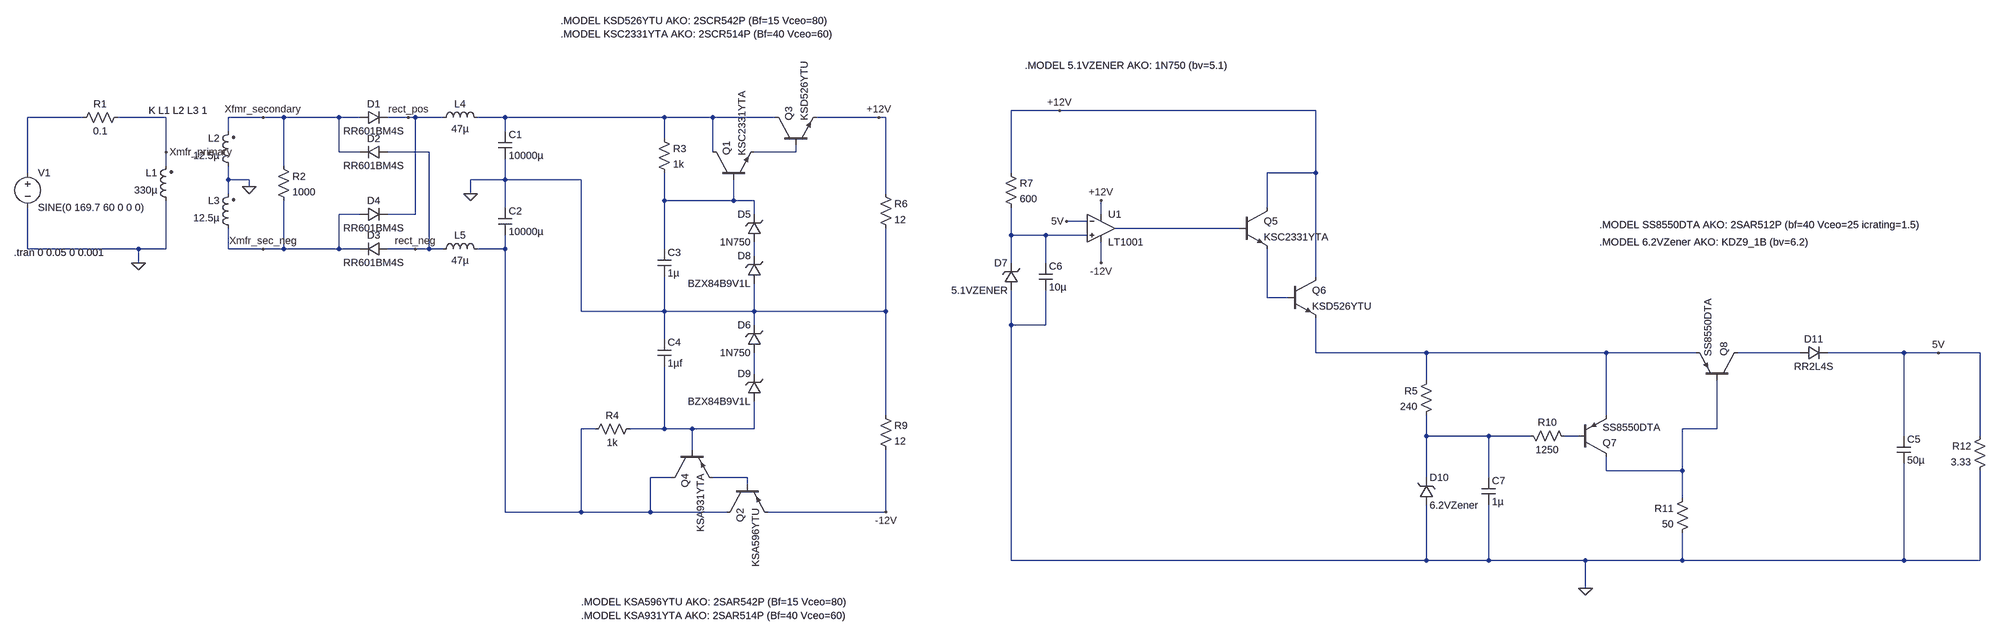
[diagram p0: schematic Power Supply V2.asc]
Power Supply V2.asc, the LTspice schematic file:
Version 4
SHEET 1 4836 1164
WIRE 2448 -16 2336 -16
WIRE 3040 -16 2448 -16
WIRE 32 0 -96 0
WIRE 224 0 112 0
WIRE 448 0 368 0
WIRE 496 0 448 0
WIRE 624 0 496 0
WIRE 672 0 624 0
WIRE 784 0 736 0
WIRE 800 0 784 0
WIRE 864 0 800 0
WIRE 1008 0 944 0
WIRE 1376 0 1008 0
WIRE 1488 0 1376 0
WIRE 1632 0 1488 0
WIRE 1872 0 1728 0
WIRE 1888 0 1872 0
WIRE 368 32 368 0
WIRE 1008 32 1008 0
WIRE 1376 48 1376 0
WIRE 224 80 224 0
WIRE 624 80 624 0
WIRE 672 80 624 80
WIRE 832 80 736 80
WIRE 1488 80 1488 0
WIRE 1680 80 1680 64
WIRE 1680 80 1584 80
WIRE 224 112 224 80
WIRE 496 112 496 0
WIRE -96 128 -96 0
WIRE 2336 128 2336 -16
WIRE 3040 128 3040 -16
WIRE 3040 128 2928 128
WIRE 368 144 368 112
WIRE 416 144 368 144
WIRE 1008 144 1008 96
WIRE 1008 144 928 144
WIRE 1184 144 1008 144
WIRE 416 160 416 144
WIRE 368 176 368 144
WIRE 928 176 928 144
WIRE 1888 176 1888 0
WIRE 1376 192 1376 128
WIRE 1536 192 1536 144
WIRE 1536 192 1376 192
WIRE 1584 192 1536 192
WIRE 1008 208 1008 144
WIRE 2928 208 2928 128
WIRE 672 224 624 224
WIRE 800 224 800 0
WIRE 800 224 736 224
WIRE 1584 224 1584 192
WIRE 2544 224 2544 192
WIRE 2512 240 2464 240
WIRE 2864 256 2576 256
WIRE 2336 272 2336 208
WIRE 2416 272 2336 272
WIRE 2512 272 2416 272
WIRE -96 304 -96 208
WIRE 160 304 -96 304
WIRE 224 304 224 192
WIRE 224 304 160 304
WIRE 368 304 368 256
WIRE 448 304 368 304
WIRE 496 304 496 192
WIRE 496 304 448 304
WIRE 624 304 624 224
WIRE 624 304 496 304
WIRE 672 304 624 304
WIRE 800 304 736 304
WIRE 832 304 832 80
WIRE 832 304 800 304
WIRE 864 304 832 304
WIRE 1008 304 1008 272
WIRE 1008 304 944 304
WIRE 1376 304 1376 192
WIRE 1584 320 1584 288
WIRE 160 336 160 304
WIRE 2336 336 2336 272
WIRE 2416 336 2416 272
WIRE 2544 336 2544 288
WIRE 3040 368 3040 128
WIRE 2928 416 2928 304
WIRE 2976 416 2928 416
WIRE 1184 448 1184 144
WIRE 1376 448 1376 368
WIRE 1376 448 1184 448
WIRE 1584 448 1584 384
WIRE 1584 448 1376 448
WIRE 1888 448 1888 256
WIRE 1888 448 1584 448
WIRE 1584 480 1584 448
WIRE 2336 480 2336 400
WIRE 2416 480 2416 400
WIRE 2416 480 2336 480
WIRE 1376 512 1376 448
WIRE 3040 544 3040 464
WIRE 3296 544 3040 544
WIRE 3712 544 3296 544
WIRE 3920 544 3712 544
WIRE 4160 544 4016 544
WIRE 4400 544 4224 544
WIRE 4480 544 4400 544
WIRE 4576 544 4480 544
WIRE 1584 592 1584 544
WIRE 3296 608 3296 544
WIRE 1888 688 1888 448
WIRE 3712 688 3712 544
WIRE 1216 720 1184 720
WIRE 1376 720 1376 576
WIRE 1376 720 1296 720
WIRE 1440 720 1376 720
WIRE 1584 720 1584 656
WIRE 1584 720 1440 720
WIRE 3968 720 3968 608
WIRE 3968 720 3888 720
WIRE 3296 736 3296 688
WIRE 3440 736 3296 736
WIRE 3536 736 3440 736
WIRE 3648 736 3616 736
WIRE 4400 736 4400 544
WIRE 4576 736 4576 544
WIRE 1440 768 1440 720
WIRE 3712 816 3712 784
WIRE 3888 816 3888 720
WIRE 3888 816 3712 816
WIRE 1392 832 1344 832
WIRE 1568 832 1488 832
WIRE 3296 832 3296 736
WIRE 3440 832 3440 736
WIRE 1568 848 1568 832
WIRE 3888 880 3888 816
WIRE 1008 912 1008 304
WIRE 1184 912 1184 720
WIRE 1184 912 1008 912
WIRE 1344 912 1344 832
WIRE 1344 912 1184 912
WIRE 1520 912 1344 912
WIRE 1888 912 1888 768
WIRE 1888 912 1616 912
WIRE 2336 1024 2336 480
WIRE 3296 1024 3296 896
WIRE 3296 1024 2336 1024
WIRE 3440 1024 3440 896
WIRE 3440 1024 3296 1024
WIRE 3664 1024 3440 1024
WIRE 3888 1024 3888 960
WIRE 3888 1024 3664 1024
WIRE 4400 1024 4400 800
WIRE 4400 1024 3888 1024
WIRE 4576 1024 4576 816
WIRE 4576 1024 4400 1024
WIRE 3664 1088 3664 1024
FLAG 416 160 0
FLAG 160 336 0
FLAG 224 80 Xmfr_primary
FLAG 448 0 Xfmr_secondary
FLAG 448 304 Xmfr_sec_neg
FLAG 928 176 0
FLAG 800 304 rect_neg
FLAG 784 0 rect_pos
FLAG 1872 0 +12V
FLAG 1888 912 -12V
FLAG 2544 192 +12V
FLAG 2544 336 -12V
FLAG 2448 -16 +12V
FLAG 3664 1088 0
FLAG 2464 240 5V
FLAG 4480 544 5V
SYMBOL res 128 -16 R90
WINDOW 0 0 56 VBottom 2
WINDOW 3 32 56 VTop 2
SYMATTR InstName R1
SYMATTR Value 0.1
SYMBOL voltage -96 112 R0
WINDOW 123 0 0 Left 2
WINDOW 39 0 0 Left 2
SYMATTR InstName V1
SYMATTR Value SINE(0 169.7 60 0 0 0)
SYMBOL res 480 96 R0
SYMATTR InstName R2
SYMATTR Value 1000
SYMBOL ind2 240 208 R180
WINDOW 0 36 80 Left 2
WINDOW 3 36 40 Left 2
SYMATTR InstName L1
SYMATTR Value 330µ
SYMATTR Type ind
SYMBOL ind2 384 128 R180
WINDOW 0 36 80 Left 2
WINDOW 3 36 40 Left 2
SYMATTR InstName L2
SYMATTR Value 12.5µ
SYMATTR Type ind
SYMBOL ind2 384 272 R180
WINDOW 0 36 80 Left 2
WINDOW 3 36 40 Left 2
SYMATTR InstName L3
SYMATTR Value 12.5µ
SYMATTR Type ind
SYMBOL diode 672 16 R270
WINDOW 0 32 32 VTop 2
WINDOW 3 0 32 VBottom 2
SYMATTR InstName D1
SYMATTR Value RR601BM4S
SYMBOL diode 736 64 R90
WINDOW 0 0 32 VBottom 2
WINDOW 3 32 32 VTop 2
SYMATTR InstName D2
SYMATTR Value RR601BM4S
SYMBOL diode 736 288 R90
WINDOW 0 0 32 VBottom 2
WINDOW 3 32 32 VTop 2
SYMATTR InstName D3
SYMATTR Value RR601BM4S
SYMBOL diode 672 240 R270
WINDOW 0 32 32 VTop 2
WINDOW 3 0 32 VBottom 2
SYMATTR InstName D4
SYMATTR Value RR601BM4S
SYMBOL cap 992 32 R0
SYMATTR InstName C1
SYMATTR Value 10000µ
SYMBOL cap 992 208 R0
SYMATTR InstName C2
SYMATTR Value 10000µ
SYMBOL ind 848 16 R270
WINDOW 0 32 56 VTop 2
WINDOW 3 5 56 VBottom 2
SYMATTR InstName L4
SYMATTR Value 47µ
SYMBOL ind 848 320 R270
WINDOW 0 32 56 VTop 2
WINDOW 3 5 56 VBottom 2
SYMATTR InstName L5
SYMATTR Value 47µ
SYMBOL pnp 1520 848 M90
SYMATTR InstName Q2
SYMATTR Value KSA596YTU
SYMBOL res 1312 704 R90
WINDOW 0 0 56 VBottom 2
WINDOW 3 32 56 VTop 2
SYMATTR InstName R4
SYMATTR Value 1k
SYMBOL npn 1632 64 R270
SYMATTR InstName Q3
SYMATTR Value KSD526YTU
SYMBOL npn 1488 144 R270
SYMATTR InstName Q1
SYMATTR Value KSC2331YTA
SYMBOL res 1360 32 R0
SYMATTR InstName R3
SYMATTR Value 1k
SYMBOL pnp 1392 768 M90
SYMATTR InstName Q4
SYMATTR Value KSA931YTA
SYMBOL cap 1360 512 R0
SYMATTR InstName C4
SYMATTR Value 1µf
SYMBOL Opamps\\LT1001 2544 192 R0
SYMATTR InstName U1
SYMBOL zener 2352 400 R180
WINDOW 0 24 64 Left 2
WINDOW 3 24 0 Left 2
SYMATTR InstName D7
SYMATTR Value 5.1VZENER
SYMBOL res 2320 112 R0
SYMATTR InstName R7
SYMATTR Value 600
SYMBOL npn 2864 208 R0
SYMATTR InstName Q5
SYMATTR Value KSC2331YTA
SYMBOL npn 2976 368 R0
SYMATTR InstName Q6
SYMATTR Value KSD526YTU
SYMBOL res 1872 160 R0
SYMATTR InstName R6
SYMATTR Value 12
SYMBOL res 1872 672 R0
SYMATTR InstName R9
SYMATTR Value 12
SYMBOL cap 1360 304 R0
SYMATTR InstName C3
SYMATTR Value 1µ
SYMBOL zener 1600 288 R180
WINDOW 0 24 64 Left 2
WINDOW 3 24 0 Left 2
SYMATTR InstName D5
SYMATTR Value 1N750
SYMBOL zener 1600 384 R180
WINDOW 0 24 64 Left 2
WINDOW 3 24 0 Left 2
SYMATTR InstName D8
SYMATTR Value BZX84B9V1L
SYMBOL zener 1600 544 R180
WINDOW 0 24 64 Left 2
WINDOW 3 24 0 Left 2
SYMATTR InstName D6
SYMATTR Value 1N750
SYMBOL zener 1600 656 R180
WINDOW 0 24 64 Left 2
WINDOW 3 24 0 Left 2
SYMATTR InstName D9
SYMATTR Value BZX84B9V1L
SYMBOL cap 2400 336 R0
SYMATTR InstName C6
SYMATTR Value 10µ
SYMBOL res 3312 592 M0
SYMATTR InstName R5
SYMATTR Value 240
SYMBOL res 3520 720 M90
WINDOW 0 0 56 VBottom 2
WINDOW 3 32 56 VTop 2
SYMATTR InstName R10
SYMATTR Value 1250
SYMBOL pnp 3648 784 M180
SYMATTR InstName Q7
SYMATTR Value SS8550DTA
SYMBOL res 3904 864 M0
SYMATTR InstName R11
SYMATTR Value 50
SYMBOL pnp 4016 608 M270
SYMATTR InstName Q8
SYMATTR Value SS8550DTA
SYMBOL res 4592 720 M0
SYMATTR InstName R12
SYMATTR Value 3.33
SYMBOL zener 3280 896 M180
WINDOW 0 24 64 Left 2
WINDOW 3 24 0 Left 2
SYMATTR InstName D10
SYMATTR Value 6.2VZener
SYMBOL diode 4160 528 M90
WINDOW 0 0 32 VBottom 2
WINDOW 3 32 32 VTop 2
SYMATTR InstName D11
SYMATTR Value RR2L4S
SYMBOL cap 4384 736 R0
SYMATTR InstName C5
SYMATTR Value 50µ
SYMBOL cap 3424 832 R0
SYMATTR InstName C7
SYMATTR Value 1µ
TEXT 184 -16 Left 2 !K L1 L2 L3 1
TEXT -128 312 Left 2 !.tran 0 0.05 0 0.001
TEXT 1136 -224 Left 2 !.MODEL KSD526YTU AKO: 2SCR542P (Bf=15 Vceo=80)\n.MODEL KSC2331YTA AKO: 2SCR514P (Bf=40 Vceo=60)
TEXT 2368 -120 Left 2 !.MODEL 5.1VZENER AKO: 1N750 (bv=5.1)
TEXT 1184 1120 Left 2 !.MODEL KSA596YTU AKO: 2SAR542P (Bf=15 Vceo=80)\n.MODEL KSA931YTA AKO: 2SAR514P (Bf=40 Vceo=60)
TEXT 3696 288 Left 2 !.MODEL 6.2VZener AKO: KDZ9_1B (bv=6.2)
TEXT 3696 248 Left 2 !.MODEL SS8550DTA AKO: 2SAR512P (bf=40 Vceo=25 icrating=1.5)

The netlist it stands for:
* Power Supply V2.asc
R1 Xmfr_primary N001 0.1
V1 N001 0 SINE(0 169.7 60 0 0 0)
R2 Xfmr_secondary Xmfr_sec_neg 1000
L1 0 Xmfr_primary 330µ
L2 0 Xfmr_secondary 12.5µ
L3 Xmfr_sec_neg 0 12.5µ
D1 Xfmr_secondary rect_pos RR601BM4S
D2 rect_neg Xfmr_secondary RR601BM4S
D3 rect_neg Xmfr_sec_neg RR601BM4S
D4 Xmfr_sec_neg rect_pos RR601BM4S
C1 N002 0 10000µ
C2 0 N007 10000µ
L4 rect_pos N002 47µ
L5 rect_neg N007 47µ
Q2 N007 N017 -12V 0 KSA596YTU
R4 N013 N007 1k
Q3 N002 N003 +12V 0 KSD526YTU
Q1 N002 N004 N003 0 KSC2331YTA
R3 N002 N004 1k
Q4 N007 N013 N017 0 KSA931YTA
C4 0 N013 1µf
XU1 N006 5V +12V -12V N005 LT1001  ; pins In+ In- V+ V- OUT
D7 0 N006 5.1VZENER
R7 +12V N006 600
Q5 +12V N005 N009 0 KSC2331YTA
Q6 +12V N009 N010 0 KSD526YTU
R6 +12V 0 12
R9 0 -12V 12
C3 N004 0 1µ
D5 N008 N004 1N750
D8 0 N008 BZX84B9V1L
D6 N012 0 1N750
D9 N013 N012 BZX84B9V1L
C6 N006 0 10µ
R5 N010 N015 240
R10 N015 N016 1250
Q7 N014 N016 N010 0 SS8550DTA
R11 N014 0 50
Q8 N011 N014 N010 0 SS8550DTA
R12 5V 0 3.33
D10 0 N015 6.2VZener
D11 N011 5V RR2L4S
C5 5V 0 50µ
C7 N015 0 1µ
.model D D
.lib standard.dio
.model NPN NPN
.model PNP PNP
.lib standard.bjt
K L1 L2 L3 1
.tran 0 0.05 0 0.001
.MODEL KSD526YTU AKO: 2SCR542P (Bf=15 Vceo=80)
.MODEL KSC2331YTA AKO: 2SCR514P (Bf=40 Vceo=60)
.MODEL 5.1VZENER AKO: 1N750 (bv=5.1)
.MODEL KSA596YTU AKO: 2SAR542P (Bf=15 Vceo=80)
.MODEL KSA931YTA AKO: 2SAR514P (Bf=40 Vceo=60)
.MODEL 6.2VZener AKO: KDZ9_1B (bv=6.2)
.MODEL SS8550DTA AKO: 2SAR512P (bf=40 Vceo=25 icrating=1.5)
.lib LTC.lib
.backanno
.end